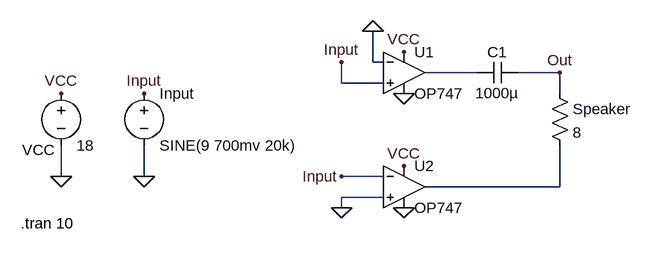
[diagram p0: schematic op_amps.asc]
op_amps.asc, the LTspice schematic file:
Version 4
SHEET 1 880 680
WIRE 80 80 80 32
WIRE 96 80 80 80
WIRE 240 96 160 96
WIRE 368 96 304 96
WIRE 32 112 32 80
WIRE 96 112 32 112
WIRE 368 128 368 96
WIRE -400 256 -400 208
WIRE -272 256 -272 208
WIRE 96 256 32 256
WIRE 368 272 368 208
WIRE 368 272 160 272
WIRE 96 288 32 288
WIRE 32 304 32 288
FLAG -400 128 VCC
FLAG 128 304 0
FLAG 128 128 0
FLAG 128 64 VCC
FLAG 128 240 VCC
FLAG 368 96 Out
FLAG -400 256 0
FLAG -272 128 Input
FLAG -272 256 0
FLAG 80 32 0
FLAG 32 304 0
FLAG 32 80 Input
FLAG 32 256 Input
SYMBOL voltage -400 112 R0
WINDOW 123 24 124 Left 2
WINDOW 39 24 152 Left 2
WINDOW 0 -60 103 Left 2
SYMATTR InstName VCC
SYMATTR Value 18
SYMBOL OpAmps\\OP747 128 32 R0
SYMATTR InstName U1
SYMBOL OpAmps\\OP747 128 208 R0
SYMATTR InstName U2
SYMBOL res 352 112 R0
SYMATTR InstName Speaker
SYMATTR Value 8
SYMBOL voltage -272 112 R0
WINDOW 123 0 0 Left 0
WINDOW 39 0 0 Left 0
SYMATTR InstName Input
SYMATTR Value SINE(9 700mv 20k)
SYMBOL cap 304 80 R90
WINDOW 0 0 32 VBottom 2
WINDOW 3 32 32 VTop 2
SYMATTR InstName C1
SYMATTR Value 1000µ
TEXT -462 328 Left 2 !.tran 10

The netlist it stands for:
* op_amps.asc
VCC VCC 0 18
XU1 Input 0 VCC 0 N001 OP747  ; pins In+ In- V+ V- OUT
XU2 0 Input VCC 0 N002 OP747  ; pins In+ In- V+ V- OUT
R§Speaker Out N002 8
V§Input Input 0 SINE(9 700mv 20k)
C1 Out N001 1000µ
.tran 10
.backanno
.end